# Altium project dv_analog.PrjPcb
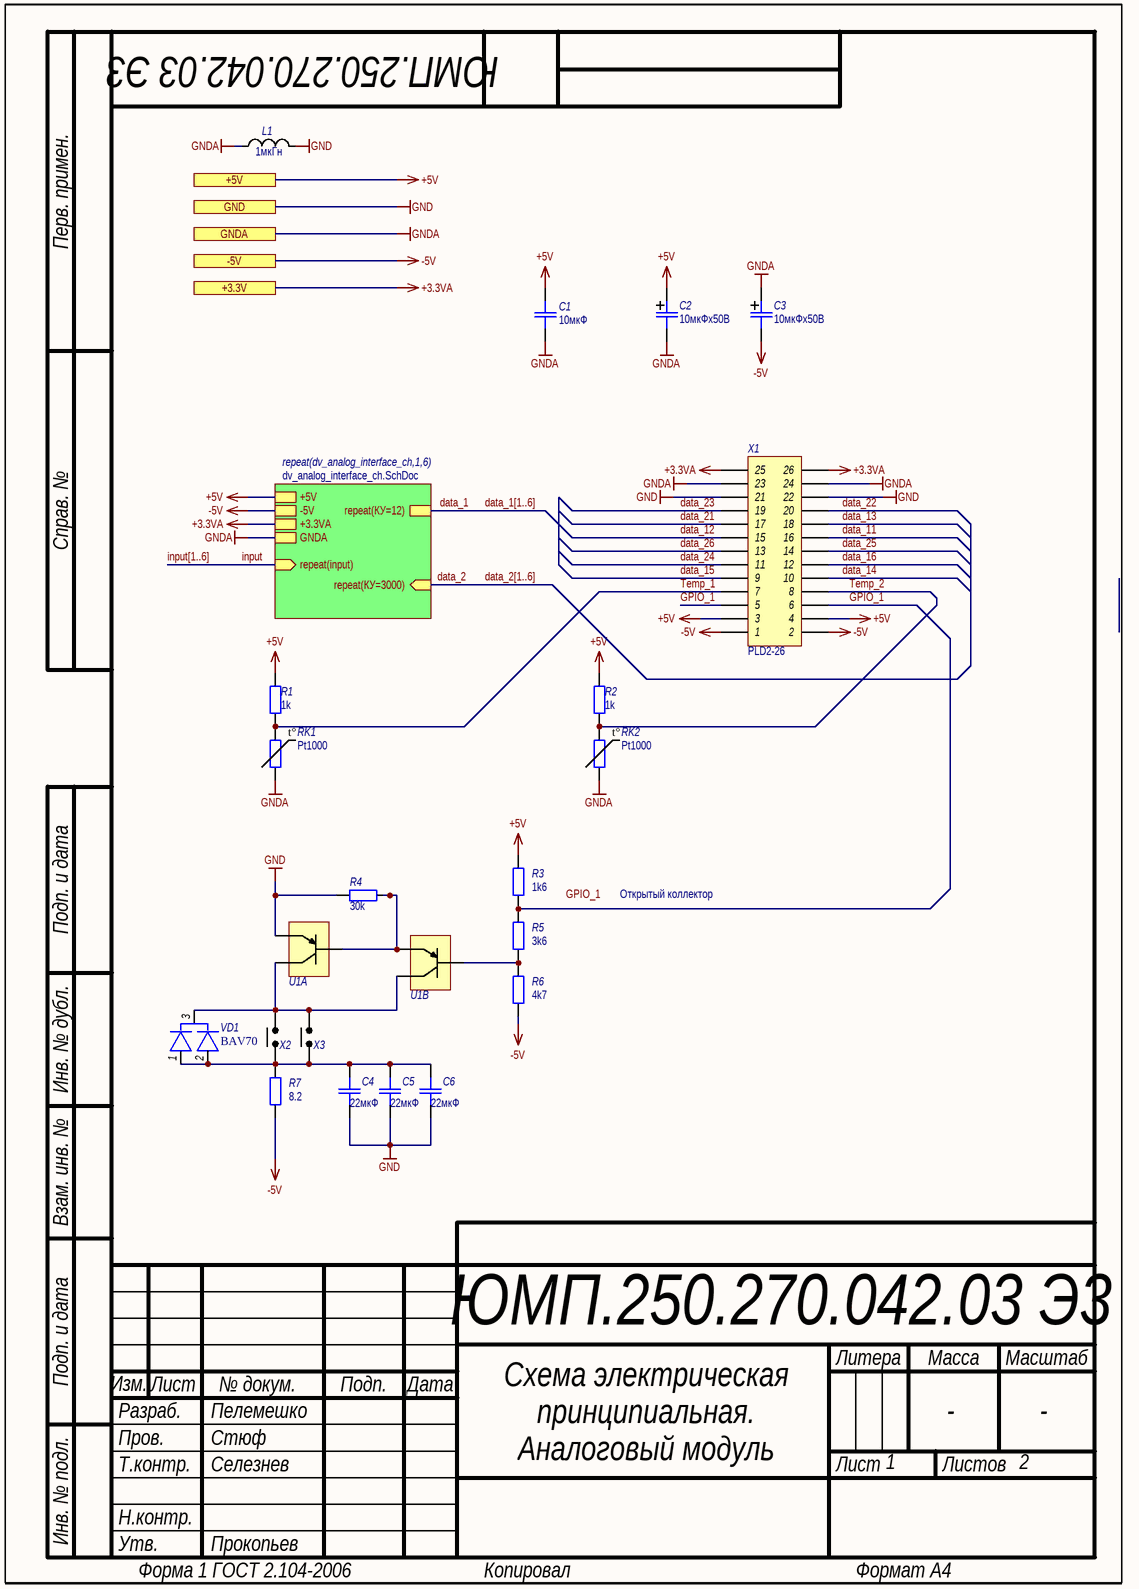
[diagram p0: dv_analog_main.SchDoc]
GlobalOrganizationName: НГУ; GlobalProjectName1: Схема электрическая; GlobalProjectName2: принципиальная.; GlobalProjectName3: Аналоговый модуль; GlobalProjectNumber: ЮМП.250.270.042.03 Э3; GlobalProjectRevision: #1.0; Норм.Контр.: Задорожная; Проверил: Стюф; Разработал: Пелемешко; Т.Контр.: Селезнев; Утвердил: Прокопьев
3 sheets, 247 parts. Net scope: hierarchical (ports join the sheet entries above them; power ports are global).
Board file: dv_analog_6_ch.PcbDoc
Sheets:
  dv_analog_main.SchDoc
    dv_analog_interface_ch1 = dv_analog_interface_ch.SchDoc
    dv_analog_interface_ch2 = dv_analog_interface_ch.SchDoc
    dv_analog_interface_ch3 = dv_analog_interface_ch.SchDoc
    dv_analog_interface_ch4 = dv_analog_interface_ch.SchDoc
    dv_analog_interface_ch5 = dv_analog_interface_ch.SchDoc
    dv_analog_interface_ch6 = dv_analog_interface_ch.SchDoc
  dv_analog_interface_627.SchDoc

## Sheet dv_analog_main.SchDoc: =GlobalProjectName
size 209 x 297 mm; ApprovedBy: Прокопьев; CheckedBy: Стюф; Author: Пелемешко; Organization: НГУ; DocumentNumber: 2; Revision: #1.0; SheetNumber: 1; SheetTotal: 2; PageSetup: Record=PageOptions|CenterHorizontal=True|CenterVertical=True|PrintScale=1.00|XCorrection=1.00|YCorrection=1.00|PrintKind=1|BorderSize=5000000|LeftOffset=0|BottomOffset=0|Orientation=2|PaperLength=1000|PaperWidth=1000|Scale=100|PaperSource=15|PrintQuality=1200|MediaType=1|DitherType=10|PaperKind=A3|PrintScaleMode=1; Weight: -; ScaleFactor: -; NormInspection: Задорожная; FirstApplication: ЮМП.250.270.042.03 Э3

### Parts
(Parts that share a designator on the sheet are numbered #1, #2 ... from top to bottom, then left to right.)
C1  value 10мкФ  [SMD_C0805]  (hidden comment: K10-79)
C2#1  value 10мкФх50В  [SMD_size_B]  (hidden comment: OS K53-68)
C3  value 10мкФх50В  [SMD_size_B]  (hidden comment: OS K53-68)
C4  value 22мкФ  [SMD_C1206]  (hidden comment: K10-79)
C5  value 22мкФ  [SMD_C1206]  (hidden comment: K10-79)
C6  value 22мкФ  [SMD_C1206]  (hidden comment: K10-79)
L1  value 1мкГн  [SMD_0805]  (hidden comment: Inductor)
R1  value 1k  [SMD_0805]  (hidden comment: OSM R1-12)
R2#1  value 1k  [SMD_0805]  (hidden comment: OSM R1-12)
R3  value 1k6  [SMD_0805]  (hidden comment: OSM R1-12)
R4  value 30k  [SMD_0805]  (hidden comment: OSM R1-12)
R5  value 3k6  [SMD_0805]  (hidden comment: OSM R1-12)
R6  value 4k7  [SMD_0805]  (hidden comment: OSM R1-12)
R7#1  value 8.2  [SMD_0805]  (hidden comment: OSM R1-12)
RK1  Pt1000  [Pt1000_3.0x1.0]
RK2  Pt1000  [Pt1000_3.0x1.0]
U1  2ТС622А1 OC  [14PIN FLATPACK]  (value not drawn)  (parts A,B of 4)
VD1  BAV70  [SOT-23]
X1  Header 2X26  [PLD2-26]  (value not drawn)
X2  Jumper 2  [PLS-2]  (value not drawn)
X3  Jumper 2  [PLS-2]  (value not drawn)

### Sub-sheets
repeat(dv_analog_interface_ch,1,6) = dv_analog_interface_ch.SchDoc: GNDA, repeat(input) (in), +5V, +3.3VA, -5V, repeat(КУ=12), repeat(КУ=3000) (in)

### Ports
+3.3V, +5V, -5V, GND, GNDA

### Nets
+3.3VA: X1.25 X1.26 ; port +3.3V, sheet repeat(dv_analog_interface_ch,1,6)/+3.3VA
+5V: C1.2 C2#1.1 R1.2 R2#1.2 R3.2 X1.3 X1.4 ; port +5V, sheet repeat(dv_analog_interface_ch,1,6)/+5V
-5V: C3.2 R6.1 R7#1.2 X1.1 X1.2 ; port -5V, sheet repeat(dv_analog_interface_ch,1,6)/-5V
GND: C4.2 C5.2 C6.2 L1.2 R4.2 U1.13(Эммитер) X1.21 X1.22 ; port GND
GNDA: C1.1 C2#1.2 C3.1 L1.1 RK1.2 RK2.2 X1.23 X1.24 ; port GNDA, sheet repeat(dv_analog_interface_ch,1,6)/GNDA
data_1: sheet repeat(dv_analog_interface_ch,1,6)/repeat(КУ=12)
data_2: sheet repeat(dv_analog_interface_ch,1,6)/repeat(КУ=3000)
data_11: X1.16
data_12: X1.15
data_13: X1.18
data_14: X1.10
data_15: X1.9
data_16: X1.12
data_21: X1.17
data_22: X1.20  [project net data_21]
data_23: X1.19  [project net data_21]
data_24: X1.11  [project net data_21]
data_25: X1.14  [project net data_21]
data_26: X1.13  [project net data_21]
GPIO_1: R3.1 R5.2 X1.5 X1.6
input: sheet repeat(dv_analog_interface_ch,1,6)/repeat(input)
Temp_1: R1.1 RK1.1 X1.7
Temp_2: R2#1.1 RK2.1 X1.8
NetC4_1: C4.1 C5.1 C6.1 R7#1.1 VD1.1 VD1.2 X2.1 X3.1
NetR4_1: R4.1 U1.2(База) U1.3(Эммитер)
NetR5_1: R5.1 R6.2 U1.12(База)
NetU1_4: U1.4(Коллектор) U1.14(Коллектор) VD1.3 X2.2 X3.2

### Buses and harness runs
bus data_1[1..6]
bus data_2[1..6]
bus input[1..6]

### Notes on the sheet
- Открытый коллектор
- Labels drawn without touching a wire or pin: GPIO_1
- Перв. примен.
- Справ. №
- Подп. и дата
- Инв. № дубл.
- Взам. инв. №
- Разраб.
- Изм.
- Лист
- № докум.
- Подп.
- Дата
- Литера
- Масса
- Масштаб
- Пров.
- Т.контр.
- Листов
- Инв. № подл.
- Н.контр.
- Утв.
- Форма 1 ГОСТ 2.104-2006
- Копировал
- Формат А4
- (in symbol Pt1000) t°

### Library data of the parts
C1 C4-C6 = Capacitor: Назначение: SMD-конденсатор; Наименование: К10-79; Потребление, Вт: 0; Напряжение: В; Точность: %
C2#1 C3 = Capacitor_pol: Polarized capacitor; Назначение: Поляризованный SMD-конденсатор; Наименование: ОС К53-68; Потребление, Вт: 0; Точность: %; Напряжение: В; Диэлектрик: *
L1 = Inductor: Наименование: Индуктивность; Назначение: SMD-индуктивность; Потребление, Вт: 0,010
R1 R2#1 R3-R6 R7#1 = Resistor: Наименование: ОСМ Р1-12; Назначение: SMD-резистор; Потребление, Вт: 0,001; Точность: %
RK1 RK2 = Pt1000: Платиновый термометр сопротивления; Value: 1000; Потребление, Вт: 0,001; Назначение: Термометр сопротивления; ComponentLink1Description: DataSheet; ComponentLink1URL: https://ru.mouser.com/datasheet/2/619/M310_HST-USA-1131966.pdf; Наименование: Pt1000
U1 = 2TS622A1 OS: Назначение: Матрица транзисторная; Наименование: 2ТС622А1 OC
VD1 = BAV70: Назначение: Диодная сборка; Наименование: BAV70; ComponentLink1Description: DataSheet; ComponentLink1URL: https://static.chipdip.ru/lib/635/DOC005635893.pdf
X1 = Header 2X26: Header, 26-Pin, Dual row; Назначение: Header, 20-Pin, Dual row; Потребление, Вт: 0,0; Наименование: PLD2-26
X2 X3 = Jumper 2: Jumper, 2-Pin, Dual row; Потребление, Вт: 0,0; Наименование: Jumper 2-pin; Назначение: Jumper, 2-Pin, Dual row

## Sheet dv_analog_interface_ch.SchDoc
size 209 x 297 mm; DocumentNumber: 1; SheetNumber: 2; SheetTotal: 2; PageSetup: Record=PageOptions|CenterHorizontal=True|CenterVertical=True|PrintScale=1.00|XCorrection=1.00|YCorrection=1.00|PrintKind=1|BorderSize=5000000|LeftOffset=0|BottomOffset=0|Orientation=2|PaperLength=1000|PaperWidth=1000|Scale=100|PaperSource=15|PrintQuality=1200|MediaType=1|DitherType=10|PaperKind=A3|PrintScaleMode=1; Weight: -; ScaleFactor: -; NormInspection: Норм.Контр.; FirstApplication: ЮМП.250.270.042.03 Э3
Used 6 times, as channels dv_analog_interface_ch1, dv_analog_interface_ch2, dv_analog_interface_ch3, dv_analog_interface_ch4, dv_analog_interface_ch5, dv_analog_interface_ch6. Parts and nets are listed once, with the designators drawn on the sheet.
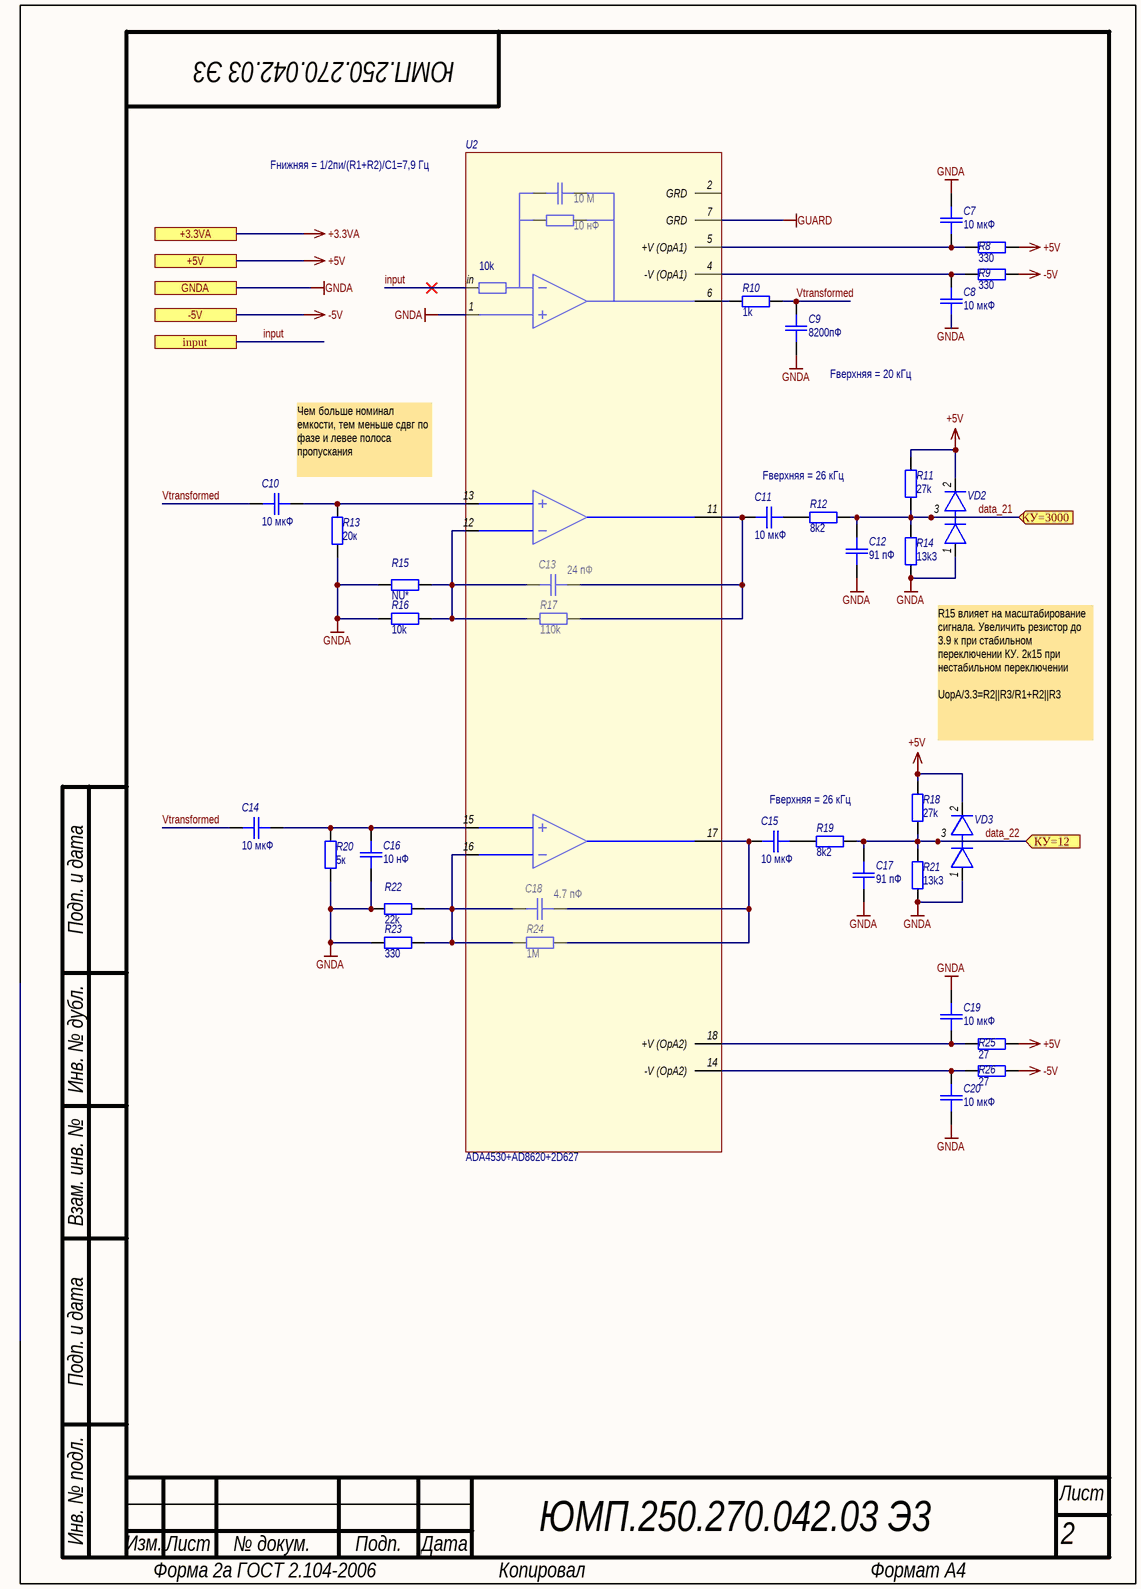
[diagram p1: dv_analog_interface_ch.SchDoc]

### Parts
C7  value 10 мкФ  [SMD_C0805]  (hidden comment: K10-79)
C8  value 10 мкФ  [SMD_C0805]  (hidden comment: K10-79)
C9  value 8200пФ  [SMD_C0805]  (hidden comment: K10-79)
C10  value 10 мкФ  [SMD_C0805]  (hidden comment: K10-79)
C11  value 10 мкФ  [SMD_C0805]  (hidden comment: K10-79)
C12  value 91 пФ  [SMD_C0805]  (hidden comment: K10-79)
C13  value 24 пФ  [SMD_C0805]  (hidden comment: K10-79)
C14  value 10 мкФ  [SMD_C0805]  (hidden comment: K10-79)
C15  value 10 мкФ  [SMD_C0805]  (hidden comment: K10-79)
C16  value 10 нФ  [SMD_C0805]  (hidden comment: K10-79)
C17  value 91 пФ  [SMD_C0805]  (hidden comment: K10-79)
C18  value 4.7 пФ  [SMD_C0805]  (hidden comment: K10-79)
C19  value 10 мкФ  [SMD_C0805]  (hidden comment: K10-79)
C20  value 10 мкФ  [SMD_C0805]  (hidden comment: K10-79)
R8  value 330  [SMD_0805]  (hidden comment: OSM R1-12)
R9  value 330  [SMD_0805]  (hidden comment: OSM R1-12)
R10  value 1k  [SMD_0805]  (hidden comment: OSM R1-12)
R11  value 27k  [SMD_0805]  (hidden comment: OSM R1-12)
R12  value 8k2  [SMD_0805]  (hidden comment: OSM R1-12)
R13  value 20к  [SMD_0805]  (hidden comment: OSM R1-12)
R14  value 13k3  [SMD_0805]  (hidden comment: OSM R1-12)
R15  value NU*  [SMD_0805]  (hidden comment: OSM R1-12)
R16  value 10k  [SMD_0805]  (hidden comment: OSM R1-12)
R17  value 110k  [SMD_0805]  (hidden comment: OSM R1-12)
R18  value 27k  [SMD_0805]  (hidden comment: OSM R1-12)
R19  value 8k2  [SMD_0805]  (hidden comment: OSM R1-12)
R20  value 5к  [SMD_0805]  (hidden comment: OSM R1-12)
R21  value 13k3  [SMD_0805]  (hidden comment: OSM R1-12)
R22  value 22k  [SMD_0805]  (hidden comment: OSM R1-12)
R23  value 330  [SMD_0805]  (hidden comment: OSM R1-12)
R24  value 1M  [SMD_0805]  (hidden comment: OSM R1-12)
R25  value 27  [SMD_0805]  (hidden comment: OSM R1-12)
R26  value 27  [SMD_0805]  (hidden comment: OSM R1-12)
U2  ADA4530+AD8620+2D627  [401.16-3+soic]
VD2  BAT54SW  [SOT-323 (SC-70)]  (value not drawn)
VD3  BAT54SW  [SOT-323 (SC-70)]  (value not drawn)

### Ports
+3.3VA, +5V, -5V, GNDA, input, КУ=12 (in), КУ=3000 (in)

### Nets
+3.3VA: port +3.3VA
+5V: R8.2 R11.2 R18.2 R25.2 VD2.2 VD3.2 ; port +5V
-5V: R9.1 R26.1 ; port -5V
GNDA: C7.1 C8.2 C9.1 C12.1 C16.1 C17.1 C19.1 C20.2 R13.1 R14.1 R15.2 R16.2 R20.1 R21.1 R22.2 R23.2 U2.1 VD2.1 VD3.1 ; port GNDA
GUARD: U2.7(GRD)
data_21: C12.2 R11.1 R12.2 R14.2 VD2.3 ; port КУ=3000
data_22: C17.2 R18.1 R19.2 R21.2 VD3.3 ; port КУ=12
input: U2.in ; port input
Vtransformed: C9.2 C10.2 C14.2 R10.2
NetC7_2: C7.2 R8.1 U2.5(+V_(OpA1))
NetC8_1: C8.1 R9.2 U2.4(-V_(OpA1))
NetC10_1: C10.1 R13.2 U2.13
NetC11_1: C11.1 R12.1
NetC11_2: C11.2 C13.1 R17.2 U2.11
NetC13_2: C13.2 R15.1 R16.1 R17.1 U2.12
NetC14_1: C14.1 C16.2 R20.2 U2.15
NetC15_1: C15.1 R19.1
NetC15_2: C15.2 C18.1 R24.2 U2.17
NetC18_2: C18.2 R22.1 R23.1 R24.1 U2.16
NetC19_2: C19.2 R25.1 U2.18(+V_(OpA2))
NetC20_1: C20.1 R26.2 U2.14(-V_(OpA2))
NetR10_1: R10.1 U2.6

Not connected (* = marked no-connect by the designer): U2 2 *(2) input(*)

### Channels
dv_analog_interface_ch1: designators C7=C2#2 C8=C8_dv_analog_interface_ch1 C9=C9_dv_analog_interface_ch1 C10=C10_dv_analog_interface_ch1 C11=C11_dv_analog_interface_ch1 C12=C7 C13=C13_dv_analog_interface_ch1 C14=C14_dv_analog_interface_ch1 C15=C15_dv_analog_interface_ch1 C16=C16_dv_analog_interface_ch1 C17=C17_dv_analog_interface_ch1 C18=C18_dv_analog_interface_ch1 C19=C19_dv_analog_interface_ch1 C20=C20_dv_analog_interface_ch1 R8=R2#2 R9=R9_dv_analog_interface_ch1 R10=R10_dv_analog_interface_ch1 R11=R7#2 R12=R8 R13=R13_dv_analog_interface_ch1 R14=R9 R15=R15_dv_analog_interface_ch1 R16=R16_dv_analog_interface_ch1 R17=R17_dv_analog_interface_ch1 R18=R18_dv_analog_interface_ch1 R19=R19_dv_analog_interface_ch1 R20=R20_dv_analog_interface_ch1 R21=R21_dv_analog_interface_ch1 R22=R22_dv_analog_interface_ch1 R23=R23_dv_analog_interface_ch1 R24=R24_dv_analog_interface_ch1 R25=R25_dv_analog_interface_ch1 R26=R26_dv_analog_interface_ch1 U2=U2_dv_analog_interface_ch1 VD2=VD2_dv_analog_interface_ch1 VD3=VD3_dv_analog_interface_ch1; ports +3.3VA=+3.3VA +5V=+5V -5V=-5V GNDA=GNDA input=input_dv_analog_interface_ch1 КУ=12=data_11 КУ=3000=data_21
dv_analog_interface_ch2: designators C7=C14 C8=C8_dv_analog_interface_ch2 C9=C9_dv_analog_interface_ch2 C10=C10_dv_analog_interface_ch2 C11=C11_dv_analog_interface_ch2 C12=C19 C13=C13_dv_analog_interface_ch2 C14=C14_dv_analog_interface_ch2 C15=C15_dv_analog_interface_ch2 C16=C16_dv_analog_interface_ch2 C17=C17_dv_analog_interface_ch2 C18=C18_dv_analog_interface_ch2 C19=C19_dv_analog_interface_ch2 C20=C20_dv_analog_interface_ch2 R8=R21 R9=R9_dv_analog_interface_ch2 R10=R10_dv_analog_interface_ch2 R11=R26 R12=R27#1 R13=R13_dv_analog_interface_ch2 R14=R28#1 R15=R15_dv_analog_interface_ch2 R16=R16_dv_analog_interface_ch2 R17=R17_dv_analog_interface_ch2 R18=R18_dv_analog_interface_ch2 R19=R19_dv_analog_interface_ch2 R20=R20_dv_analog_interface_ch2 R21=R21_dv_analog_interface_ch2 R22=R22_dv_analog_interface_ch2 R23=R23_dv_analog_interface_ch2 R24=R24_dv_analog_interface_ch2 R25=R25_dv_analog_interface_ch2 R26=R26_dv_analog_interface_ch2 U2=U2_dv_analog_interface_ch2 VD2=VD2_dv_analog_interface_ch2 VD3=VD3_dv_analog_interface_ch2; ports +3.3VA=+3.3VA +5V=+5V -5V=-5V GNDA=GNDA input=input_dv_analog_interface_ch2 КУ=12=data_12 КУ=3000=data_21
dv_analog_interface_ch3: designators C7=C26 C8=C8_dv_analog_interface_ch3 C9=C9_dv_analog_interface_ch3 C10=C10_dv_analog_interface_ch3 C11=C11_dv_analog_interface_ch3 C12=C31 C13=C13_dv_analog_interface_ch3 C14=C14_dv_analog_interface_ch3 C15=C15_dv_analog_interface_ch3 C16=C16_dv_analog_interface_ch3 C17=C17_dv_analog_interface_ch3 C18=C18_dv_analog_interface_ch3 C19=C19_dv_analog_interface_ch3 C20=C20_dv_analog_interface_ch3 R8=R40 R9=R9_dv_analog_interface_ch3 R10=R10_dv_analog_interface_ch3 R11=R45 R12=R46 R13=R13_dv_analog_interface_ch3 R14=R47 R15=R15_dv_analog_interface_ch3 R16=R16_dv_analog_interface_ch3 R17=R17_dv_analog_interface_ch3 R18=R18_dv_analog_interface_ch3 R19=R19_dv_analog_interface_ch3 R20=R20_dv_analog_interface_ch3 R21=R21_dv_analog_interface_ch3 R22=R22_dv_analog_interface_ch3 R23=R23_dv_analog_interface_ch3 R24=R24_dv_analog_interface_ch3 R25=R25_dv_analog_interface_ch3 R26=R26_dv_analog_interface_ch3 U2=U2_dv_analog_interface_ch3 VD2=VD2_dv_analog_interface_ch3 VD3=VD3_dv_analog_interface_ch3; ports +3.3VA=+3.3VA +5V=+5V -5V=-5V GNDA=GNDA input=input_dv_analog_interface_ch3 КУ=12=data_13 КУ=3000=data_21
dv_analog_interface_ch4: designators C7=C38 C8=C8_dv_analog_interface_ch4 C9=C9_dv_analog_interface_ch4 C10=C10_dv_analog_interface_ch4 C11=C11_dv_analog_interface_ch4 C12=C43 C13=C13_dv_analog_interface_ch4 C14=C14_dv_analog_interface_ch4 C15=C15_dv_analog_interface_ch4 C16=C16_dv_analog_interface_ch4 C17=C17_dv_analog_interface_ch4 C18=C18_dv_analog_interface_ch4 C19=C19_dv_analog_interface_ch4 C20=C20_dv_analog_interface_ch4 R8=R59 R9=R9_dv_analog_interface_ch4 R10=R10_dv_analog_interface_ch4 R11=R64 R12=R65 R13=R13_dv_analog_interface_ch4 R14=R66 R15=R15_dv_analog_interface_ch4 R16=R16_dv_analog_interface_ch4 R17=R17_dv_analog_interface_ch4 R18=R18_dv_analog_interface_ch4 R19=R19_dv_analog_interface_ch4 R20=R20_dv_analog_interface_ch4 R21=R21_dv_analog_interface_ch4 R22=R22_dv_analog_interface_ch4 R23=R23_dv_analog_interface_ch4 R24=R24_dv_analog_interface_ch4 R25=R25_dv_analog_interface_ch4 R26=R26_dv_analog_interface_ch4 U2=U2_dv_analog_interface_ch4 VD2=VD2_dv_analog_interface_ch4 VD3=VD3_dv_analog_interface_ch4; ports +3.3VA=+3.3VA +5V=+5V -5V=-5V GNDA=GNDA input=input_dv_analog_interface_ch4 КУ=12=data_14 КУ=3000=data_21
dv_analog_interface_ch5: designators C7=C50 C8=C8_dv_analog_interface_ch5 C9=C9_dv_analog_interface_ch5 C10=C10_dv_analog_interface_ch5 C11=C11_dv_analog_interface_ch5 C12=C55 C13=C13_dv_analog_interface_ch5 C14=C14_dv_analog_interface_ch5 C15=C15_dv_analog_interface_ch5 C16=C16_dv_analog_interface_ch5 C17=C17_dv_analog_interface_ch5 C18=C18_dv_analog_interface_ch5 C19=C19_dv_analog_interface_ch5 C20=C20_dv_analog_interface_ch5 R8=R78 R9=R9_dv_analog_interface_ch5 R10=R10_dv_analog_interface_ch5 R11=R83 R12=R84 R13=R13_dv_analog_interface_ch5 R14=R85 R15=R15_dv_analog_interface_ch5 R16=R16_dv_analog_interface_ch5 R17=R17_dv_analog_interface_ch5 R18=R18_dv_analog_interface_ch5 R19=R19_dv_analog_interface_ch5 R20=R20_dv_analog_interface_ch5 R21=R21_dv_analog_interface_ch5 R22=R22_dv_analog_interface_ch5 R23=R23_dv_analog_interface_ch5 R24=R24_dv_analog_interface_ch5 R25=R25_dv_analog_interface_ch5 R26=R26_dv_analog_interface_ch5 U2=U2_dv_analog_interface_ch5 VD2=VD2_dv_analog_interface_ch5 VD3=VD3_dv_analog_interface_ch5; ports +3.3VA=+3.3VA +5V=+5V -5V=-5V GNDA=GNDA input=input_dv_analog_interface_ch5 КУ=12=data_15 КУ=3000=data_21
dv_analog_interface_ch6: designators C7=C62 C8=C8_dv_analog_interface_ch6 C9=C9_dv_analog_interface_ch6 C10=C10_dv_analog_interface_ch6 C11=C11_dv_analog_interface_ch6 C12=C67 C13=C13_dv_analog_interface_ch6 C14=C14_dv_analog_interface_ch6 C15=C15_dv_analog_interface_ch6 C16=C16_dv_analog_interface_ch6 C17=C17_dv_analog_interface_ch6 C18=C18_dv_analog_interface_ch6 C19=C19_dv_analog_interface_ch6 C20=C20_dv_analog_interface_ch6 R8=R97 R9=R9_dv_analog_interface_ch6 R10=R10_dv_analog_interface_ch6 R11=R102 R12=R103 R13=R13_dv_analog_interface_ch6 R14=R104 R15=R15_dv_analog_interface_ch6 R16=R16_dv_analog_interface_ch6 R17=R17_dv_analog_interface_ch6 R18=R18_dv_analog_interface_ch6 R19=R19_dv_analog_interface_ch6 R20=R20_dv_analog_interface_ch6 R21=R21_dv_analog_interface_ch6 R22=R22_dv_analog_interface_ch6 R23=R23_dv_analog_interface_ch6 R24=R24_dv_analog_interface_ch6 R25=R25_dv_analog_interface_ch6 R26=R26_dv_analog_interface_ch6 U2=U2_dv_analog_interface_ch6 VD2=VD2_dv_analog_interface_ch6 VD3=VD3_dv_analog_interface_ch6; ports +3.3VA=+3.3VA +5V=+5V -5V=-5V GNDA=GNDA input=input_dv_analog_interface_ch6 КУ=12=data_16 КУ=3000=data_21

### Notes on the sheet
- (near U2) Fнижняя = 1/2пи/(R1+R2)/C1=7,9 Гц
- Fверхняя = 20 кГц
- Чем больше номинал емкости, тем меньше сдвг по фазе и левее полоса пропускания
- Fверхняя = 26 кГц
- R15 влияет на масштабирование сигнала. Увеличить резистор до 3.9 к при стабильном переключении КУ. 2к15 при нестабильном переключении
  UopA/3.3=R2||R3/R1+R2||R3
- Подп. и дата
- Инв. № дубл.
- Взам. инв. №
- Инв. № подл.
- Изм.
- Лист
- № докум.
- Подп.
- Дата
- Форма 2а ГОСТ 2.104-2006
- Копировал
- Формат А4
- (in symbol ADA4530+AD8620+2D627) 10 М; 10 нФ; 10k

### Library data of the parts
C7-C20 = Capacitor: as C1 on sheet dv_analog_main
R8-R26 = Resistor: as R1 on sheet dv_analog_main
VD2 VD3 = BAT54SW: Schottky diodes; Назначение: Диодная сборка; ComponentLink1Description: DataSheet; Наименование: BAT54SW

## Sheet dv_analog_interface_627.SchDoc
size 410 x 297 mm; DocumentNumber: 3
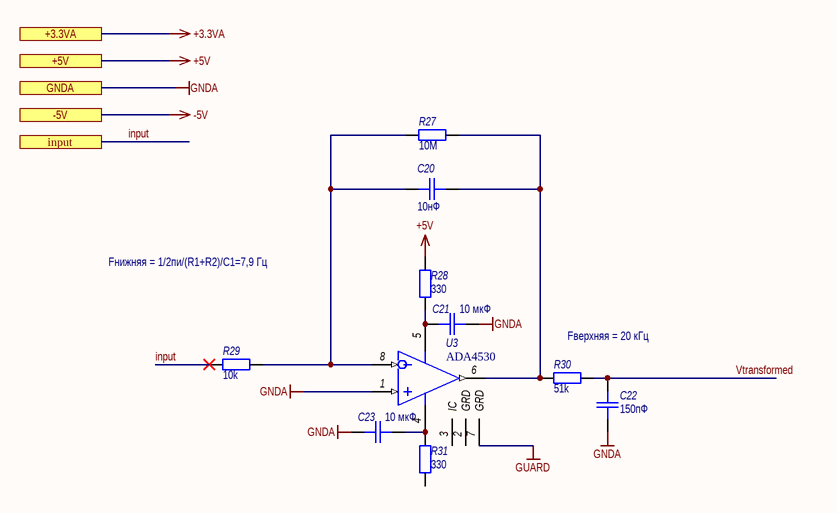
[diagram p2: dv_analog_interface_627.SchDoc]

### Parts
(Parts that share a designator on the sheet are numbered #1, #2 ... from top to bottom, then left to right.)
C20  value 10нФ  [SMD_C0805]  (hidden comment: K10-79)
C21  value 10 мкФ  [SMD_C0805]  (hidden comment: K10-79)
C22  value 150пФ  [SMD_C0805]  (hidden comment: K10-79)
C23  value 10 мкФ  [SMD_C0805]  (hidden comment: K10-79)
R27#2  value 10M  [SMD_0805]  (hidden comment: OSM R1-12)
R28#2  value 330  [SMD_0805]  (hidden comment: OSM R1-12)
R29  value 10k  [SMD_0805]  (hidden comment: OSM R1-12)
R30  value 51k  [SMD_0805]  (hidden comment: OSM R1-12)
R31  value 330  [SMD_0805]  (hidden comment: OSM R1-12)
U3  ADA4530  [SOIC-8]

### Ports
+3.3VA, +5V, -5V, GNDA, input

### Nets
+5V: R28#2.2 ; port +5V
GNDA: C21.1 C22.1 C23.2 U3.1(IN+) ; port GNDA
GUARD: U3.7(GRD)
input: R29.1 ; port input
Vtransformed: C22.2 R30.2
NetC20_1: C20.1 R27#2.1 R29.2 U3.8(IN-)
NetC20_2: C20.2 R27#2.2 R30.1 U3.6(OUT)
NetC21_2: C21.2 R28#2.1 U3.5(V+)
NetC23_1: C23.1 R31.2 U3.4(V-)

Not connected (* = marked no-connect by the designer): R31 1; U3 2(GRD) 3(IC)

### Notes on the sheet
- Fнижняя = 1/2пи/(R1+R2)/C1=7,9 Гц
- Fверхняя = 20 кГц
- Подп. и дата
- Инв. № дубл.
- Взам. инв. №
- Инв. № подл.
- Изм.
- Лист
- № докум.
- Подп.
- Дата
- Форма 2а ГОСТ 2.104-2006
- Копировал
- Формат А3

### Library data of the parts
C20-C23 = Capacitor: as C1 on sheet dv_analog_main
R27#2 R28#2 R29-R31 = Resistor: as R1 on sheet dv_analog_main
U3 = ADA4530: Ultra-Low Bias Current Difet OpAmp; Назначение: Операционный усилитель; Потребление, Вт: 0,005; Наименование: ADA4530

## Nets that join several sheets
+5V: dv_analog_main (7 pins), dv_analog_interface_ch1 (6 pins), dv_analog_interface_ch2 (6 pins), dv_analog_interface_ch3 (6 pins), dv_analog_interface_ch4 (6 pins), dv_analog_interface_ch5 (6 pins), dv_analog_interface_ch6 (6 pins), dv_analog_interface_627 (R28#2.2)
-5V: dv_analog_main (5 pins), dv_analog_interface_ch1 (R9_dv_analog_interface_ch1.1 R26_dv_analog_interface_ch1.1), dv_analog_interface_ch2 (R9_dv_analog_interface_ch2.1 R26_dv_analog_interface_ch2.1), dv_analog_interface_ch3 (R9_dv_analog_interface_ch3.1 R26_dv_analog_interface_ch3.1), dv_analog_interface_ch4 (R9_dv_analog_interface_ch4.1 R26_dv_analog_interface_ch4.1), dv_analog_interface_ch5 (R9_dv_analog_interface_ch5.1 R26_dv_analog_interface_ch5.1), dv_analog_interface_ch6 (R9_dv_analog_interface_ch6.1 R26_dv_analog_interface_ch6.1)
GNDA: dv_analog_main (8 pins), dv_analog_interface_ch1 (19 pins), dv_analog_interface_ch2 (19 pins), dv_analog_interface_ch3 (19 pins), dv_analog_interface_ch4 (19 pins), dv_analog_interface_ch5 (19 pins), dv_analog_interface_ch6 (19 pins), dv_analog_interface_627 (C21.1 C22.1 C23.2 U3.1)
GUARD: dv_analog_interface_ch1 (U2_dv_analog_interface_ch1.7), dv_analog_interface_ch2 (U2_dv_analog_interface_ch2.7), dv_analog_interface_ch3 (U2_dv_analog_interface_ch3.7), dv_analog_interface_ch4 (U2_dv_analog_interface_ch4.7), dv_analog_interface_ch5 (U2_dv_analog_interface_ch5.7), dv_analog_interface_ch6 (U2_dv_analog_interface_ch6.7), dv_analog_interface_627 (U3.7)
data_11: dv_analog_main (X1.16), dv_analog_interface_ch1 (5 pins)
data_12: dv_analog_main (X1.15), dv_analog_interface_ch2 (5 pins)
data_13: dv_analog_main (X1.18), dv_analog_interface_ch3 (5 pins)
data_14: dv_analog_main (X1.10), dv_analog_interface_ch4 (5 pins)
data_15: dv_analog_main (X1.9), dv_analog_interface_ch5 (5 pins)
data_16: dv_analog_main (X1.12), dv_analog_interface_ch6 (5 pins)
data_21: dv_analog_main (X1.11), dv_analog_interface_ch4 (5 pins)
data_21: dv_analog_main (X1.13), dv_analog_interface_ch6 (5 pins)
data_21: dv_analog_main (X1.14), dv_analog_interface_ch5 (5 pins)
data_21: dv_analog_main (X1.17), dv_analog_interface_ch1 (5 pins)
data_21: dv_analog_main (X1.19), dv_analog_interface_ch3 (5 pins)
data_21: dv_analog_main (X1.20), dv_analog_interface_ch2 (5 pins)